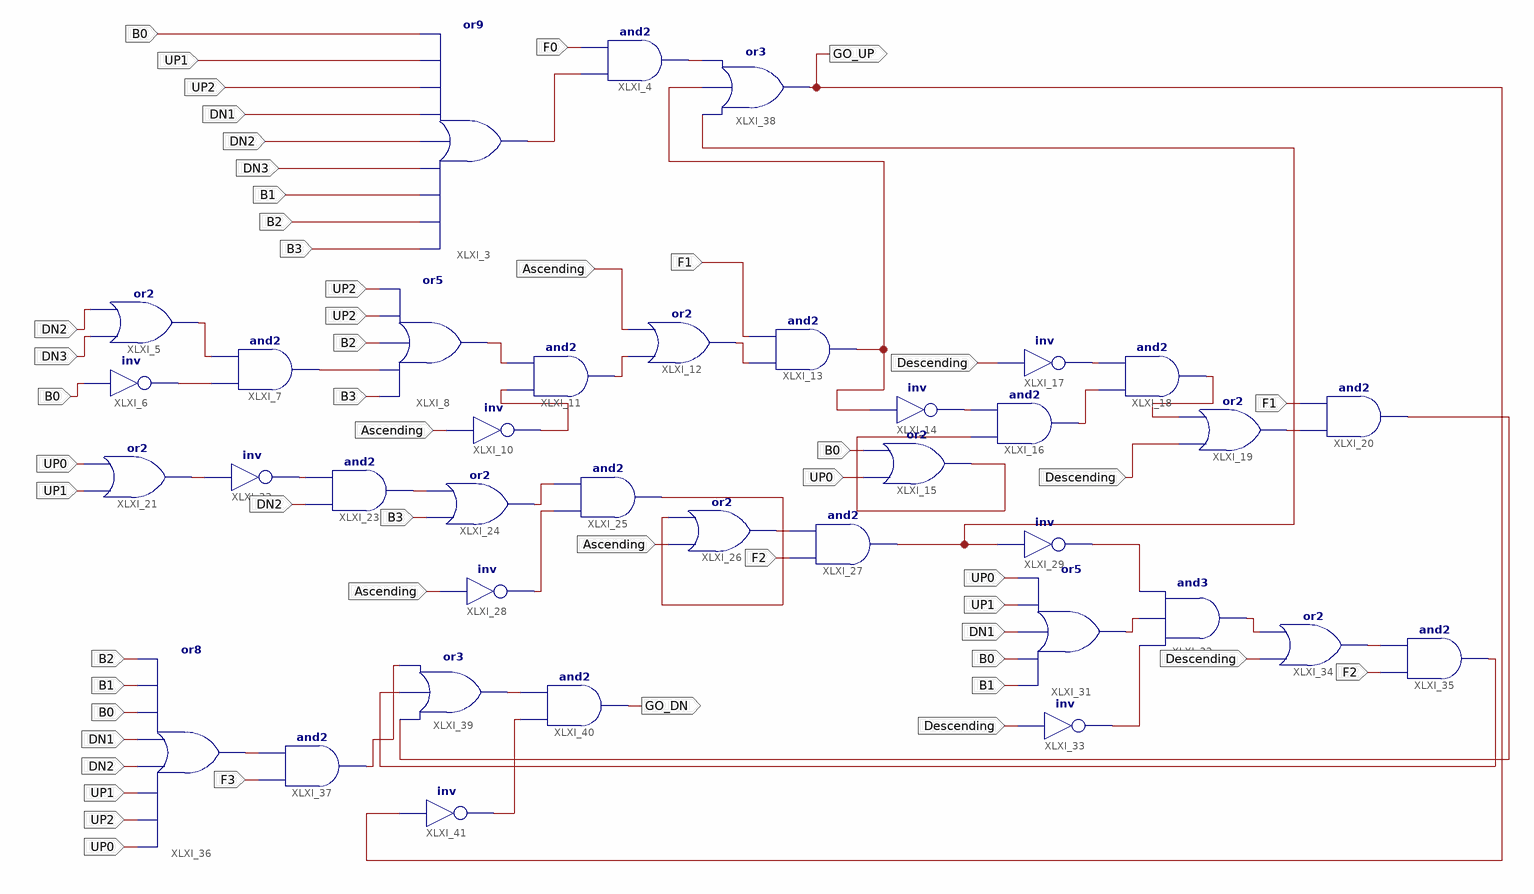
[diagram p0: schematic sheet 1]
// Xilinx ISE schematic circuit1.sch (spartan6) as structural Verilog: 37 symbols, 18 ports
module circuit1 (
  input  B0,
  input  UP1,
  input  UP2,
  input  DN1,
  input  DN3,
  input  B1,
  input  B2,
  input  B3,
  input  DN2,
  input  F1,
  input  UP0,
  input  Descending,
  input  F2,
  input  Ascending,
  input  F3,
  input  F0,
  output GO_UP,
  output GO_DN
);

  wire GO_UPKHUI, XLXN_20, XLXN_22, XLXN_37, XLXN_44, XLXN_45, XLXN_49, XLXN_50, XLXN_54, XLXN_55, XLXN_56,
       XLXN_79, XLXN_82, XLXN_83, XLXN_84, XLXN_85, XLXN_86, XLXN_87, XLXN_89, XLXN_98, XLXN_108, XLXN_119,
       XLXN_120, XLXN_121, XLXN_125, XLXN_126, XLXN_134, XLXN_147, XLXN_161, XLXN_171, XLXN_172, XLXN_173,
       XLXN_177, XLXN_178, XLXN_179;

  or XLXI_3 (XLXN_147, B3, B2, B1, DN3, DN2, DN1, UP2, UP1, B0);
  and XLXI_4 (GO_UPKHUI, XLXN_147, F0);
  or XLXI_5 (XLXN_22, DN3, DN2);
  not XLXI_6 (XLXN_20, B0);
  and XLXI_7 (XLXN_37, XLXN_20, XLXN_22);
  or XLXI_8 (XLXN_50, B3, XLXN_37, B2, UP2, UP2);
  not XLXI_10 (XLXN_49, Ascending);
  and XLXI_11 (XLXN_44, XLXN_49, XLXN_50);
  or XLXI_12 (XLXN_45, XLXN_44, Ascending);
  and XLXI_13 (XLXN_171, XLXN_45, F1);
  not XLXI_14 (XLXN_54, XLXN_171);
  or XLXI_15 (XLXN_83, UP0, B0);
  and XLXI_16 (XLXN_82, XLXN_83, XLXN_54);
  not XLXI_17 (XLXN_55, Descending);
  and XLXI_18 (XLXN_56, XLXN_82, XLXN_55);
  or XLXI_19 (XLXN_79, Descending, XLXN_56);
  and XLXI_20 (XLXN_172, XLXN_79, F1);
  or XLXI_21 (XLXN_84, UP1, UP0);
  not XLXI_22 (XLXN_85, XLXN_84);
  and XLXI_23 (XLXN_86, DN2, XLXN_85);
  or XLXI_24 (XLXN_87, B3, XLXN_86);
  and XLXI_25 (XLXN_108, XLXN_98, XLXN_87);
  or XLXI_26 (XLXN_89, Ascending, XLXN_108);
  and XLXI_27 (XLXN_161, F2, XLXN_89);
  not XLXI_28 (XLXN_98, Ascending);
  not XLXI_29 (XLXN_125, XLXN_161);
  or XLXI_31 (XLXN_119, B1, B0, DN1, UP1, UP0);
  and XLXI_32 (XLXN_120, XLXN_126, XLXN_119, XLXN_125);
  not XLXI_33 (XLXN_126, Descending);
  or XLXI_34 (XLXN_121, Descending, XLXN_120);
  and XLXI_35 (XLXN_173, F2, XLXN_121);
  or XLXI_36 (XLXN_134, UP0, UP2, UP1, DN2, DN1, B0, B1, B2);
  and XLXI_37 (XLXN_177, F3, XLXN_134);
  or XLXI_38 (GO_UP, XLXN_161, XLXN_171, GO_UPKHUI);
  or XLXI_39 (XLXN_178, XLXN_172, XLXN_173, XLXN_177);
  and XLXI_40 (GO_DN, XLXN_179, XLXN_178);
  not XLXI_41 (XLXN_179, GO_UP);
endmodule
